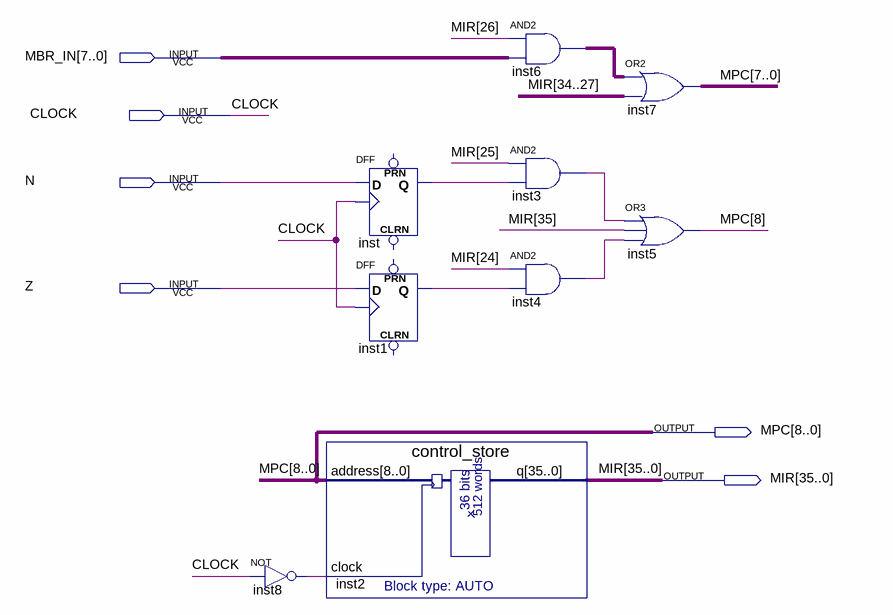
[diagram p0: schematic sheet]
// Quartus schematic CONTROL_UNIT.bdf as structural Verilog: 9 symbols, 6 pins
module CONTROL_UNIT (
  input  [7:0] MBR_IN,
  input  CLOCK,
  input  N,
  input  Z,
  output [8:0] MPC,
  output [35:0] MIR
);

  wire inst1_q, inst3_out, inst4_out, inst8_out, inst_q;
  wire [7:0] inst6_out;

  not inst8 (inst8_out, CLOCK);
  control_store inst2 (.address(MPC), .clock(inst8_out), .q(MIR));
  DFF inst (.CLK(CLOCK), .D(N), .Q(inst_q));  // open: CLRN, PRN
  DFF inst1 (.CLK(CLOCK), .D(Z), .Q(inst1_q));  // open: CLRN, PRN
  assign inst6_out = {8{MIR[26]}} & MBR_IN;  // AND2 inst6, 8 bits wide
  and inst3 (inst3_out, MIR[25], inst_q);
  and inst4 (inst4_out, MIR[24], inst1_q);
  assign MPC[7:0] = inst6_out | MIR[34:27];  // OR2 inst7, 8 bits wide
  or inst5 (MPC[8], inst3_out, MIR[35], inst4_out);
endmodule
